# Altium schematic sheet current_amplification.SchDoc
size A4; SheetNumber: 9; SheetTotal: 14
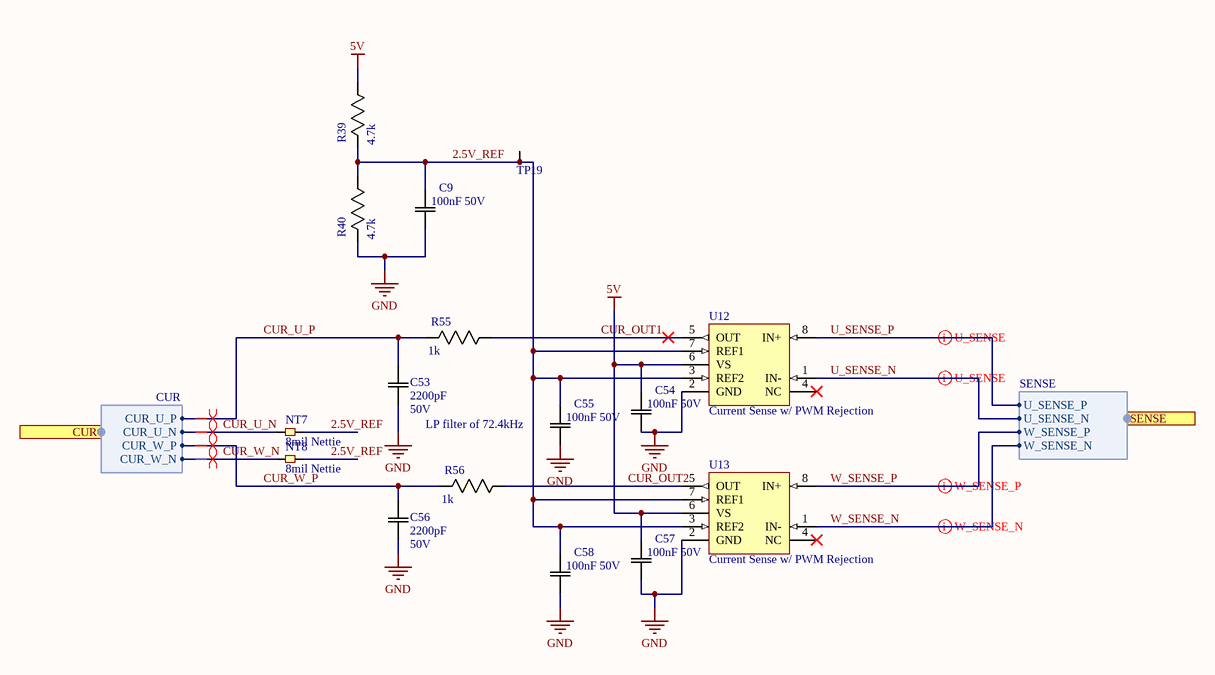
[diagram p0: current_amplification.SchDoc]

## Parts
C9  100nF 50V  [0603]
C53  value 2200pF  Rating: 50V  [0603]  (hidden comment: 2200pF 50V)
C54  100nF 50V  [0603]
C55  100nF 50V  [0603]
C56  value 2200pF  Rating: 50V  [0603]  (hidden comment: 2200pF 50V)
C57  100nF 50V  [0603]
C58  100nF 50V  [0603]
NT7  8mil Nettie  [NT_8mil]  (net tie, no BOM)
NT8  8mil Nettie  [NT_8mil]  (net tie, no BOM)
R39  4.7k  [0603]
R40  4.7k  [0603]
R55  1k  [0603]
R56  1k  [0603]
TP19  2.5V  [TP]  (value not drawn)  (no BOM)
U12  Current Sense w/ PWM Rejection  [8-SOIC]
U13  Current Sense w/ PWM Rejection  [8-SOIC]

## Ports
CUR (harness CUR), SENSE (harness SENSE)

## Harnesses
CUR: CUR_U_P, CUR_W_P, CUR_U_N, CUR_W_N
SENSE: U_SENSE_P, U_SENSE_N, W_SENSE_P, W_SENSE_N

## Nets
5V: C54.2(C2) C57.2(C2) R39.1(R1) U12.6(VS) U13.6(VS)
GND: C9.1(C1) C53.1(C1) C54.1(C1) C55.1(C1) C56.1(C1) C57.1(C1) C58.1(C1) R40.2(R2) U12.2(GND) U13.2(GND)
2.5V_REF: C9.2(C2) C55.2(C2) C58.2(C2) NT7.2 NT8.2 R39.2(R2) R40.1(R1) TP19.1 U12.3(REF2) U12.7(REF1) U13.3(REF2) U13.7(REF1)
CUR_OUT1: R55.1(R1) U12.5(OUT)
CUR_OUT2: R56.1(R1) U13.5(OUT)
CUR_U_N: NT7.1 ; port CUR.CUR_U_N
CUR_U_P: C53.2(C2) R55.2(R2) ; port CUR.CUR_U_P
CUR_W_N: NT8.1 ; port CUR.CUR_W_N
CUR_W_P: C56.2(C2) R56.2(R2) ; port CUR.CUR_W_P
U_SENSE_N: U12.1(IN-) ; port SENSE.U_SENSE_N
U_SENSE_P: U12.8(IN+) ; port SENSE.U_SENSE_P
W_SENSE_N: U13.1(IN-) ; port SENSE.W_SENSE_N
W_SENSE_P: U13.8(IN+) ; port SENSE.W_SENSE_P

Not connected (* = marked no-connect by the designer): U12 4(NC)*; U13 4(NC)*

## Layout directives
differential pair: CUR_U_N, CUR_U_P, CUR_W_N, CUR_W_P, U_SENSE_N, U_SENSE_P, W_SENSE_N, W_SENSE_P

## Notes on the sheet
- (near C55) LP filter of 72.4kHz

## Library data of the parts
C9 C54 C55 C57 C58 = CAP 100nF 50V: Default Symbol for Capacitors; Manufacturer Part Number 1: CC0603KPX7R9BB104; Tolerance: 10%; Temperature Coefficient: X7R; VALUE: 100nF; Rating: 50V; Part Number: CAP 100nF 50V; Supplier 1: Digi-Key; Supplier Part Number 1: 311-3567-1-ND; Manufacturer Part Number 2: 0805J0500104KJT; Supplier 2: Digi-Key; Supplier Part Number 2: 1608-1458-1-ND
C53 C56 = CAP 2200pF 50V: Default Symbol for Capacitors; Manufacturer Part Number 1: 06035C222KAT2A; Tolerance: 10%; Temperature Coefficient: X7R; Part Number: CAP 2200pF 50V; Supplier 1: Digi-Key; Supplier Part Number 1: 478-1219-1-ND; Manufacturer Part Number 2: CL21B222KBANNNC; Supplier 2: Digi-Key; Supplier Part Number 2: 1276-1171-1-ND
NT7 NT8 = NT_8: 8mil wide nettie; Value: 0; Part Number: NT_8
R39 R40 = RES 4.7k 1/8W - 1%: Default Resistor Symbol; Manufacturer Part Number 1: RMCF0603FT4K70; Power (Watts): 0.125W; Tolerance: 1%; Package: 0805; VALUE: 4.7k; Part Number: RES 4.7k 1/8W - 1%; Supplier 1: Digi-Key; Supplier Part Number 1: RMCF0603FT4K70CT-ND; Supplier URL 1: https://www.digikey.ca/en/products/detail/stackpole-electronics-inc/RMCF0603FT4K70/1760998
R55 R56 = RES 1k 1/8W - 1%: Default Resistor Symbol; Manufacturer Part Number 1: MCT06030C1001FP500; Power (Watts): 0.125W; Tolerance: 1%; Package: 0805; VALUE: 1k; Part Number: RES 1k 1/8W - 1%; Supplier 1: Digi-Key; Supplier Part Number 1: MCT0603-1.00K-CFCT-ND; Manufacturer Part Number 2: RMCF0805FT1K00; Supplier 2: Digi-Key; Supplier Part Number 2: RMCF0805FT1K00CT-ND; Tolerance 2: 1%; Supplier URL 1: https://www.digikey.ca/en/products/detail/vishay-beyschlag-draloric-bc-components/MCT06030C1001FP500/2607821?s=N4IgTCBcDaILIGEAqAGAbCgzAWgIwDoUUBpbBAMWWwDkAREAXQF8g; Supplier URL 2: https://www.digikey.ca/en/products/detail/stackpole-electronics-inc/RMCF0805FT1K00/1760090?s=N4IgTCBcDaIEoFkDCAxADADjQVhQFQEYBpNNJPEAXQF8g
TP19 = Test Point (Via): Part Number: Test Point (Via)
U12 U13 = INA240A3EDRQ1: SP Amp Current Sense Amp Single R-R O/P 5.5V Automotive 6-Pin SC-70 T/R; Part Number: INA240A3EDRQ1; Manufacturer Part Number 1: INA240A3EDRQ1; Supplier 1: Digi-Key; Supplier Part Number 1: 296-53154-1-ND; Supplier URL 1: https://www.digikey.ca/en/products/detail/texas-instruments/INA240A3EDRQ1/9861456?s=N4IgTCBcDaIJIDkCCYAsAGJBmAogEQCUBFARhAF0BfIA